# Altium schematic sheet Esquemático.SchDoc
size A4; SheetNumber: 1; SheetTotal: 1
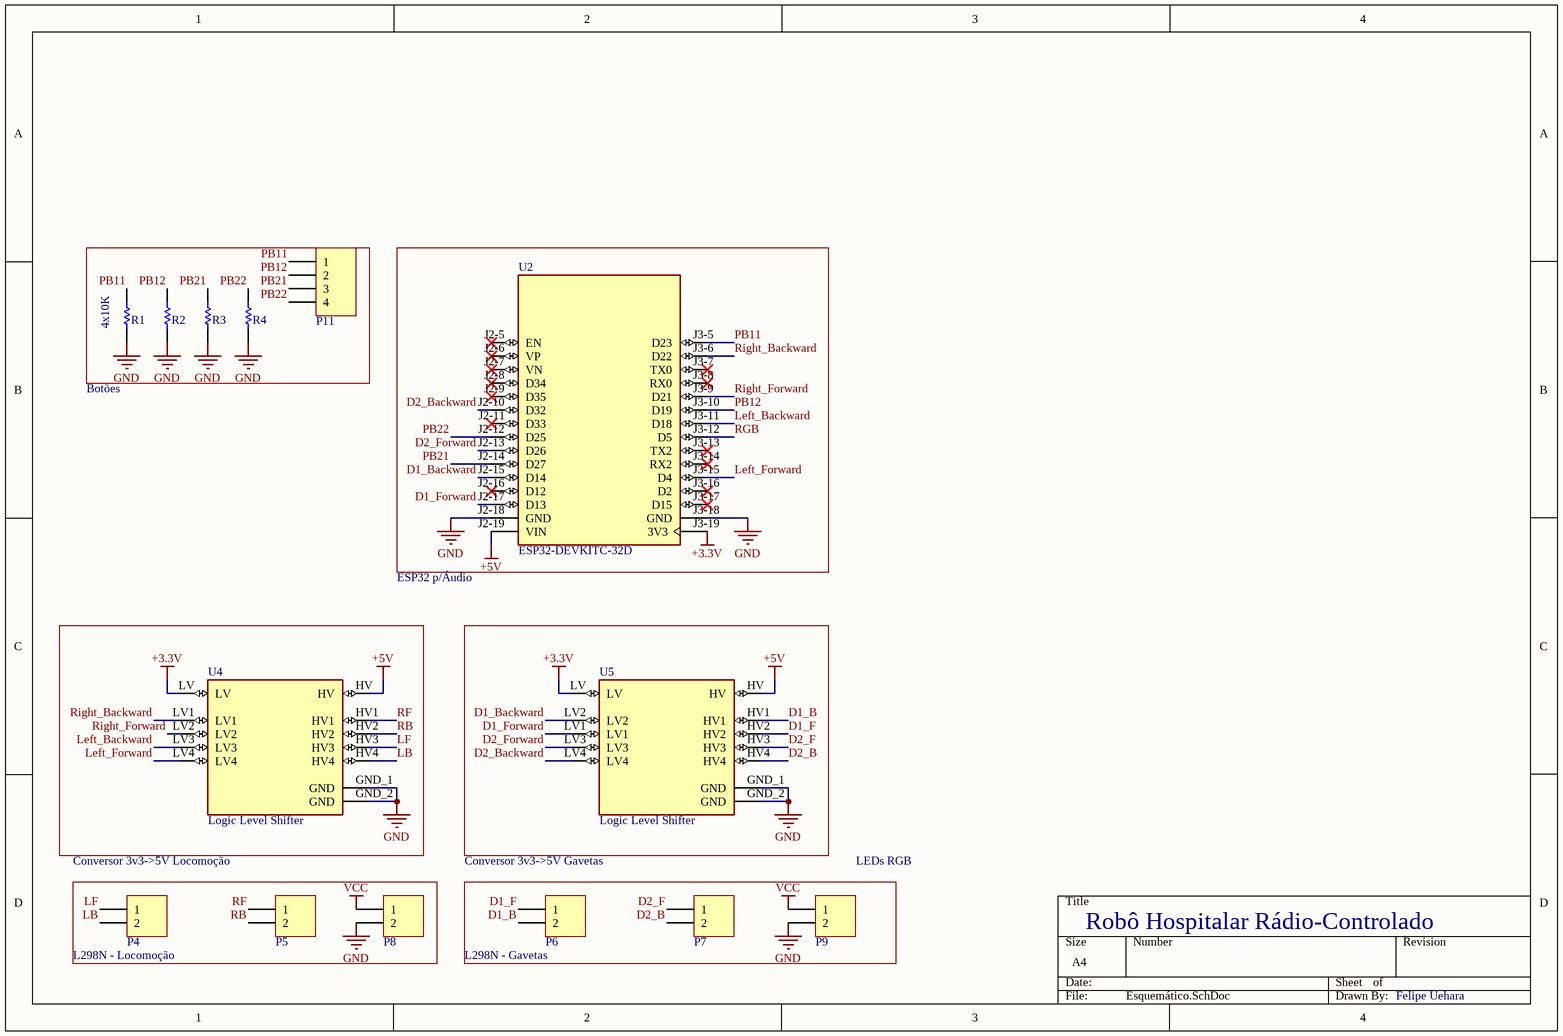
[diagram p0: Esquemático.SchDoc]

## Parts
P4  Header 1x2  [KRE1X2]  (value not drawn)
P5  Header 1x2  [KRE1X2]  (value not drawn)
P6  Header 1x2  [KRE1X2]  (value not drawn)
P7  Header 1x2  [KRE1X2]  (value not drawn)
P8  Header 1x2  [KRE1X2]  (value not drawn)
P9  Header 1x2  [KRE1X2]  (value not drawn)
P11  Header 1x4  [HDR1X4]  (value not drawn)
R1  4x10K  [RES 10K 1/4W CARBON FILM]
R2  RES 10K 1/4W CARBON FILM  [RES 10K 1/4W CARBON FILM]  (value not drawn)
R3  RES 10K 1/4W CARBON FILM  [RES 10K 1/4W CARBON FILM]  (value not drawn)
R4  RES 10K 1/4W CARBON FILM  [RES 10K 1/4W CARBON FILM]  (value not drawn)
U2  ESP32-DEVKITC-32D  [MODULE_ESP32-DEVKITC-32D - duplicate]
U4  Logic Level Shifter  [CONV_BOB-12009]
U5  Logic Level Shifter  [CONV_BOB-12009]

## Nets
+3.3V: U2.J3-19(3V3) U4.LV U5.LV
+5V: U2.J2-19(VIN) U4.HV U5.HV
GND: P8.2 P9.2 R1.1 R2.1 R3.1 R4.1 U2.J2-18(GND) U2.J3-18(GND) U4.GND_1(GND) U4.GND_2(GND) U5.GND_1(GND) U5.GND_2(GND)
VCC: P8.1 P9.1
D1_B: P6.2 U5.HV1
D1_Backward: U2.J2-15(D14) U5.LV2
D1_F: P6.1 U5.HV2
D1_Forward: U2.J2-17(D13) U5.LV1
D2_B: P7.2 U5.HV4
D2_Backward: U2.J2-10(D32) U5.LV4
D2_F: P7.1 U5.HV3
D2_Forward: U2.J2-13(D26) U5.LV3
LB: P4.2 U4.HV4
Left_Backward: U2.J3-11(D18) U4.LV3
Left_Forward: U2.J3-15(D4) U4.LV4
LF: P4.1 U4.HV3
PB11: P11.1 R1.2 U2.J3-5(D23)
PB12: P11.2 R2.2 U2.J3-10(D19)
PB21: P11.3 R3.2 U2.J2-14(D27)
PB22: P11.4 R4.2 U2.J2-12(D25)
RB: P5.2 U4.HV2
RF: P5.1 U4.HV1
RGB: U2.J3-12(D5)
Right_Backward: U2.J3-6(D22) U4.LV1
Right_Forward: U2.J3-9(D21) U4.LV2

Not connected (* = marked no-connect by the designer): U2 J2-5(EN)* J2-6(VP)* J2-7(VN)* J2-8(D34)* J2-9(D35)* J2-11(D33)* J2-16(D12)* J3-7(TX0)* J3-8(RX0)* J3-13(TX2)* J3-14(RX2)* J3-16(D2)* J3-17(D15)*

## Notes on the sheet
- Botões
- ESP32 p/Áudio
- Conversor 3v3->5V Locomoção
- Conversor 3v3->5V Gavetas
- LEDs RGB
- (near P4) L298N - Locomoção
- (near P6) L298N - Gavetas
- Robô Hospitalar Rádio-Controlado
- Felipe Uehara

## Library data of the parts
P4-P9 = Header 1x2: Manufacturer: Cromax; Manufacturer Part Number: IMP10327; Mounting Angle: Vertical; Number of Positions: 40 Position; Pitch: 2 mm; Supplier 1: Mult Comercial; RoHS: RoHS Compliant; Category: Headers & Wire Housings; Stock 1: 14; Pricing 1: 1=1.00, 5=0.20 (BRL); Accessory Type: -; Contact Plating: Gold; Contact Type: -; Number of Rows: 1 Row; Product: Headers; Termination Style: Through Hole; Type: Breakaway; Brand: Cromax; Mounting Style: Straight Pin; Row Spacing: -; Contact Gender: Pin (Male); Product Category: Accessories; RoHS - Mouser: Y; Minimum Order Quantity: 1; Reeling: False; ComponentLink1URL: http://loja.multcomercial.com.br/barra-de-pinos-simples-1x40-macho-bmo40-1e.html; ComponentLink1Description: http://loja.multcomercial.com.br/barra-de-pinos-simples-1x40-macho-bmo40-1e.html; Supplier Part Number 1: Barra de Pinos Simples 1x40 Macho BMO40-1E
P11 = Header 1x4: Headers & Wire Housings 40Pin 2mm Spacing Single Row Hdrs, 5pc; Manufacturer: Cromax; Manufacturer Part Number: IMP10327; Mounting Angle: Vertical; Number of Positions: 40 Position; Supplier 1: Mult Comercial; RoHS: RoHS Compliant; Category: Headers & Wire Housings; Stock 1: 14; Pricing 1: 1=1.00, 5=0.20 (BRL); Accessory Type: -; Contact Plating: Gold; Contact Type: -; Number of Rows: 1 Row; Product: Headers; Termination Style: Through Hole; Type: Breakaway; Brand: Cromax; Mounting Style: Straight Pin; Pitch: 2 mm; Row Spacing: -; Contact Gender: Pin (Male); Product Category: Accessories; RoHS - Mouser: Y; Minimum Order Quantity: 1; Reeling: False; ComponentLink1URL: http://loja.multcomercial.com.br/barra-de-pinos-simples-1x40-macho-bmo40-1e.html; ComponentLink1Description: http://loja.multcomercial.com.br/barra-de-pinos-simples-1x40-macho-bmo40-1e.html; Supplier Part Number 1: Barra de Pinos Simples 1x40 Macho BMO40-1E
R1-R4 = RES 10K 1/4W CARBON FILM: RES 10K OHM 1/4W 5% CARBON FILM; Manufacturer: Ty-Ohm; Manufacturer Part Number: CR25; Power (Watts): 0.25W, 1/4W; Temperature Coefficient: 0/ -500ppm/°C; Supplier 1: Mult Comercial; RoHS: RoHS Compliant; Category: Resistors; Stock 1: 617543; Pricing 1: 1=0.20 (BRL); Packaging: Cut Tape (CT); Tolerance: ±5%; Composition: Carbon Film; Features: Flame Retardant Coating, Safety; Operating Temperature: -55°C ~ 155°C; Package / Case: Axial; Supplier Device Package: Axial; Size / Dimension: 0.091" Dia x 0.256" L (2.30mm x 6.50mm); Height: -; Number of Terminations: 2; ComponentLink1URL: http://loja.multcomercial.com.br/resistor-de-1-4-de-watt-cr25-5-de-tolerancia.html; ComponentLink1Description: http://loja.multcomercial.com.br/resistor-de-1-4-de-watt-cr25-5-de-tolerancia.html; Supplier Part Number 1: Resistor de Filme de Carbono 1/4 de Watt CR25 5% de tolerância - 0.22R Ω à 10M Ω; Resistance (Ohms): ?
U2 = ESP32-DEVKITC-32D: WiFi Development Tools (802.11) ESP32 General Development Kit, ESP32-WROOM-32D on the board; MF: Espressif Systems; SnapEDA_Link: https://www.snapeda.com/parts/ESP32-DEVKITC-32D/Espressif+Systems/view-part/?ref=snap; Package: None; Value: *; MP: ESP32-DEVKITC-32D; Check_prices: https://www.snapeda.com/parts/ESP32-DEVKITC-32D/Espressif+Systems/view-part/?ref=eda
U4 U5 = Logic Level Shifter: BSS138 - Logic-Level Translator Interface Evaluation Board; MF: SparkFun; MP: BOB-12009; SnapEDA_Link: https://www.snapeda.com/parts/BOB-12009/SparkFun/view-part/?ref=snap; Package: None; Value: *; Check_prices: https://www.snapeda.com/parts/BOB-12009/SparkFun/view-part/?ref=eda